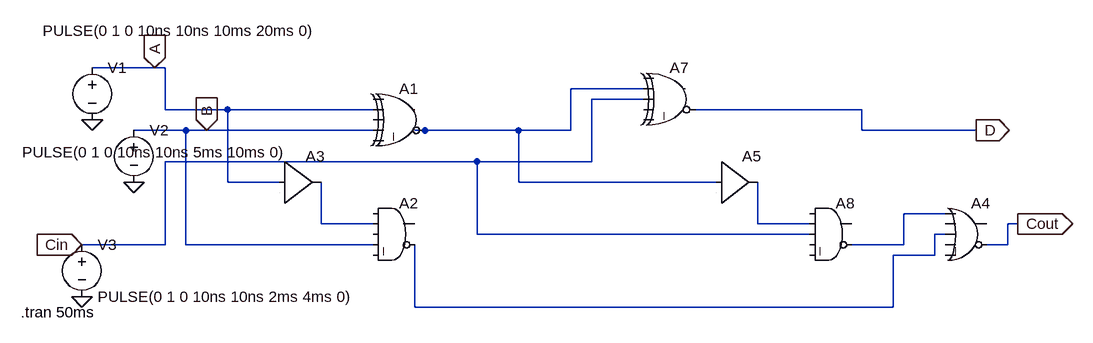
[diagram p0: schematic susbtractor.asc]
susbtractor.asc, the LTspice schematic file:
Version 4
SHEET 1 1544 712
WIRE -176 48 -272 48
WIRE -160 48 -176 48
WIRE 576 80 464 80
WIRE 576 96 496 96
WIRE -160 112 -160 48
WIRE -64 112 -160 112
WIRE 160 112 -64 112
WIRE 912 112 656 112
WIRE -128 144 -208 144
WIRE -96 144 -128 144
WIRE 160 144 -96 144
WIRE 240 144 224 144
WIRE 384 144 240 144
WIRE 464 144 464 80
WIRE 464 144 384 144
WIRE 912 144 912 112
WIRE 1088 144 912 144
WIRE 320 192 -160 192
WIRE 496 192 496 96
WIRE 496 192 320 192
WIRE -64 224 -64 112
WIRE 16 224 -64 224
WIRE 384 224 384 144
WIRE 688 224 384 224
WIRE 1040 272 976 272
WIRE 80 288 80 224
WIRE 160 288 80 288
WIRE 752 288 752 224
WIRE 832 288 752 288
WIRE 1152 288 1136 288
WIRE 320 304 320 192
WIRE 832 304 320 304
WIRE 1040 304 1024 304
WIRE -160 320 -160 192
WIRE -160 320 -288 320
WIRE -128 320 -128 144
WIRE 160 320 -128 320
WIRE 976 320 976 272
WIRE 976 320 896 320
WIRE 1136 320 1136 288
WIRE 1136 320 1104 320
WIRE 1024 336 1024 304
WIRE 1024 336 960 336
WIRE 224 416 224 320
WIRE 960 416 960 336
WIRE 960 416 224 416
FLAG -176 48 A
IOPIN -176 48 In
FLAG -96 144 B
IOPIN -96 144 In
FLAG 1088 144 D
IOPIN 1088 144 Out
FLAG 1152 288 Cout
IOPIN 1152 288 Out
FLAG -272 128 0
FLAG -208 224 0
FLAG -288 400 0
FLAG -288 320 Cin
IOPIN -288 320 In
SYMBOL Digital\\xor 208 64 R0
SYMATTR InstName A1
SYMBOL Digital\\and 192 240 R0
SYMATTR InstName A2
SYMBOL Digital\\xor 624 32 R0
SYMATTR InstName A7
SYMBOL Digital\\and 864 240 R0
SYMATTR InstName A8
SYMBOL Digital\\or 1072 240 R0
SYMATTR InstName A4
SYMBOL voltage -272 32 R0
WINDOW 3 -76 -41 Left 2
WINDOW 123 0 0 Left 0
WINDOW 39 0 0 Left 0
SYMATTR InstName V1
SYMATTR Value PULSE(0 1 0 10ns 10ns 10ms 20ms 0)
SYMBOL voltage -208 128 R0
WINDOW 3 -172 50 Left 2
WINDOW 123 0 0 Left 0
WINDOW 39 0 0 Left 0
SYMATTR InstName V2
SYMATTR Value PULSE(0 1 0 10ns 10ns 5ms 10ms 0)
SYMBOL voltage -288 304 R0
WINDOW 123 0 0 Left 0
WINDOW 39 0 0 Left 0
SYMATTR InstName V3
SYMATTR Value PULSE(0 1 0 10ns 10ns 2ms 4ms 0)
SYMBOL Digital\\buf1 16 160 R0
SYMATTR InstName A3
SYMBOL Digital\\buf1 688 160 R0
SYMATTR InstName A5
TEXT -382 424 Left 2 !.tran 50ms

The netlist it stands for:
* susbtractor.asc
A1 0 A 0 B 0 N001 0 0 XOR
A2 0 N003 0 B 0 N005 0 0 AND
A7 0 N001 Cin 0 0 D 0 0 XOR
A8 0 N004 Cin 0 0 N002 0 0 AND
A4 N002 0 N005 0 0 Cout 0 0 OR
V1 A 0 PULSE(0 1 0 10ns 10ns 10ms 20ms 0)
V2 B 0 PULSE(0 1 0 10ns 10ns 5ms 10ms 0)
V3 Cin 0 PULSE(0 1 0 10ns 10ns 2ms 4ms 0)
A3 A 0 0 0 0 0 N003 0 BUF
A5 N001 0 0 0 0 0 N004 0 BUF
.tran 50ms
.backanno
.end

* Results of the author's LTspice run, read from the files saved beside the schematic
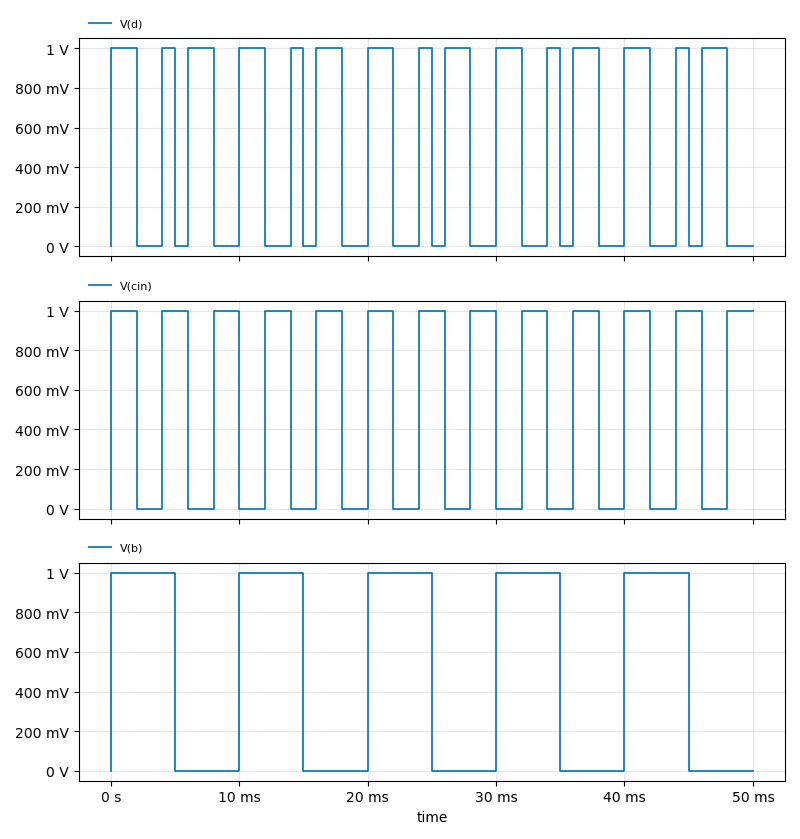
[diagram p1: Transient Analysis of susbtractor.asc, plotted from the saved traces]
* Transient Analysis, 1 run:
*   V(d): min 0 V, max 1 V, average 500 mV, rms 707.1 mV, last 0 V
*   V(cin): min 0 V, max 1 V, average 520 mV, rms 721.1 mV, last 1 V
*   V(b): min 0 V, max 1 V, average 500 mV, rms 707.1 mV, last 0 V